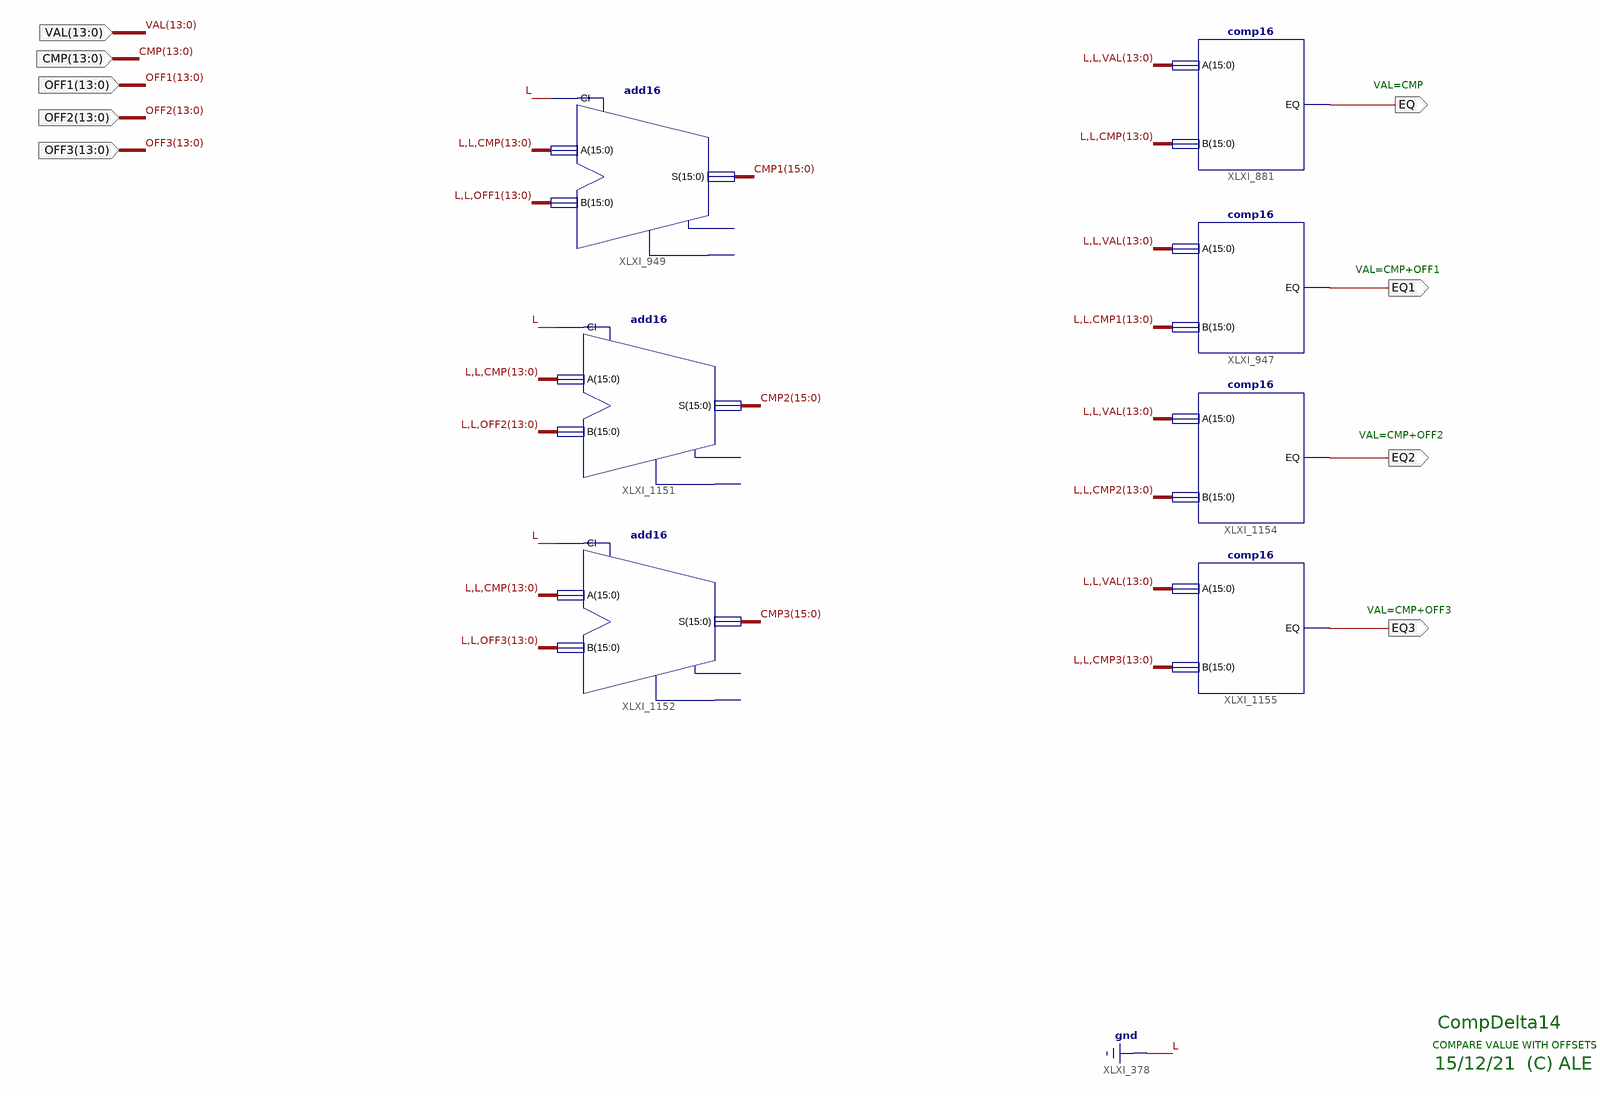
[diagram p0: schematic sheet 1]
// Xilinx ISE schematic CompDelta14.sch (spartan3e) as structural Verilog: 7 symbols, 9 ports
module CompDelta14 (
  input  [13:0] VAL,
  input  [13:0] CMP,
  input  [13:0] OFF3,
  input  [13:0] OFF2,
  input  [13:0] OFF1,
  output EQ,
  output EQ1,
  output EQ2,
  output EQ3
);

  wire [15:0] CMP1, CMP2, CMP3;

  comp16 XLXI_881 (.A({2'b00, VAL}), .B({2'b00, CMP}), .EQ(EQ));
  comp16 XLXI_947 (.A({2'b00, VAL}), .B({2'b00, CMP1[13:0]}), .EQ(EQ1));
  add16 XLXI_949 (.A({2'b00, CMP}), .B({2'b00, OFF1}), .CI(1'b0), .S(CMP1));  // open: CO, OFL
  add16 XLXI_1151 (.A({2'b00, CMP}), .B({2'b00, OFF2}), .CI(1'b0), .S(CMP2));  // open: CO, OFL
  add16 XLXI_1152 (.A({2'b00, CMP}), .B({2'b00, OFF3}), .CI(1'b0), .S(CMP3));  // open: CO, OFL
  comp16 XLXI_1154 (.A({2'b00, VAL}), .B({2'b00, CMP2[13:0]}), .EQ(EQ2));
  comp16 XLXI_1155 (.A({2'b00, VAL}), .B({2'b00, CMP3[13:0]}), .EQ(EQ3));

  // Notes on the sheet:
  //   VAL=CMP
  //   VAL=CMP+OFF1
  //   VAL=CMP+OFF2
  //   VAL=CMP+OFF3
  //   CompDelta14
  //   COMPARE VALUE WITH OFFSETS
  //   15/12/21  (C) ALE
endmodule
